# EAGLE design hs-256-expansion-debug (EAGLE 8.3.2)
DESIGNER: Jonathan P. Newman; DESIGN_NAME: headstage-256 Expansion Boards; LICENSE: CERN OHL v1.2; REVISION: 1.0
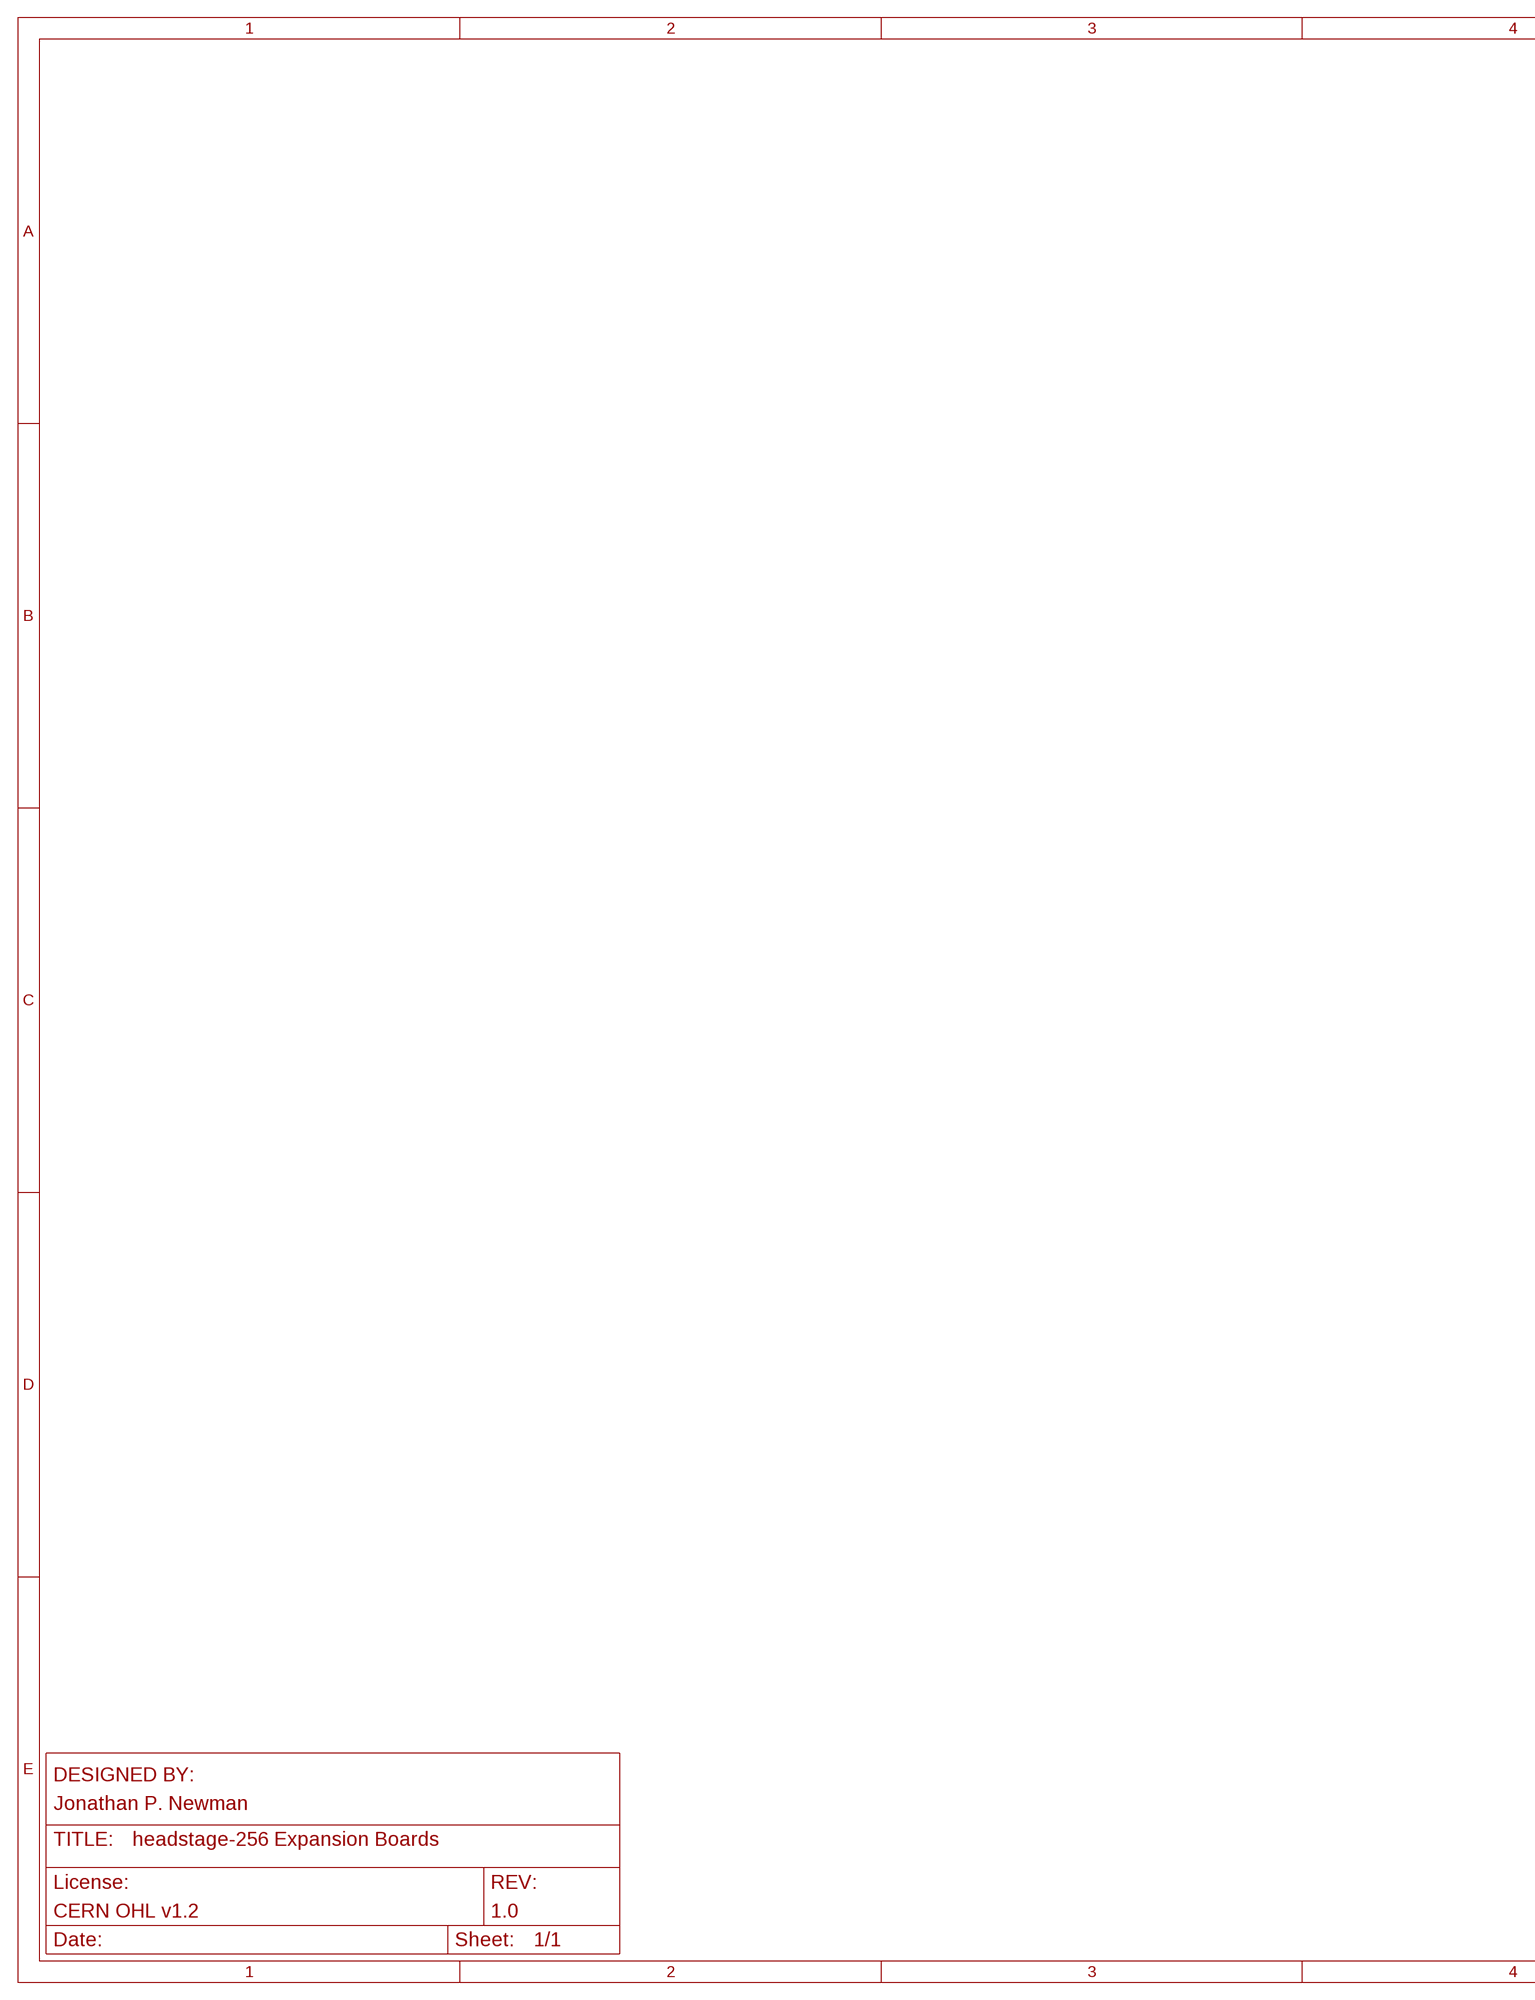
[diagram p0: schematic, sheet 1, part 1 of 2]
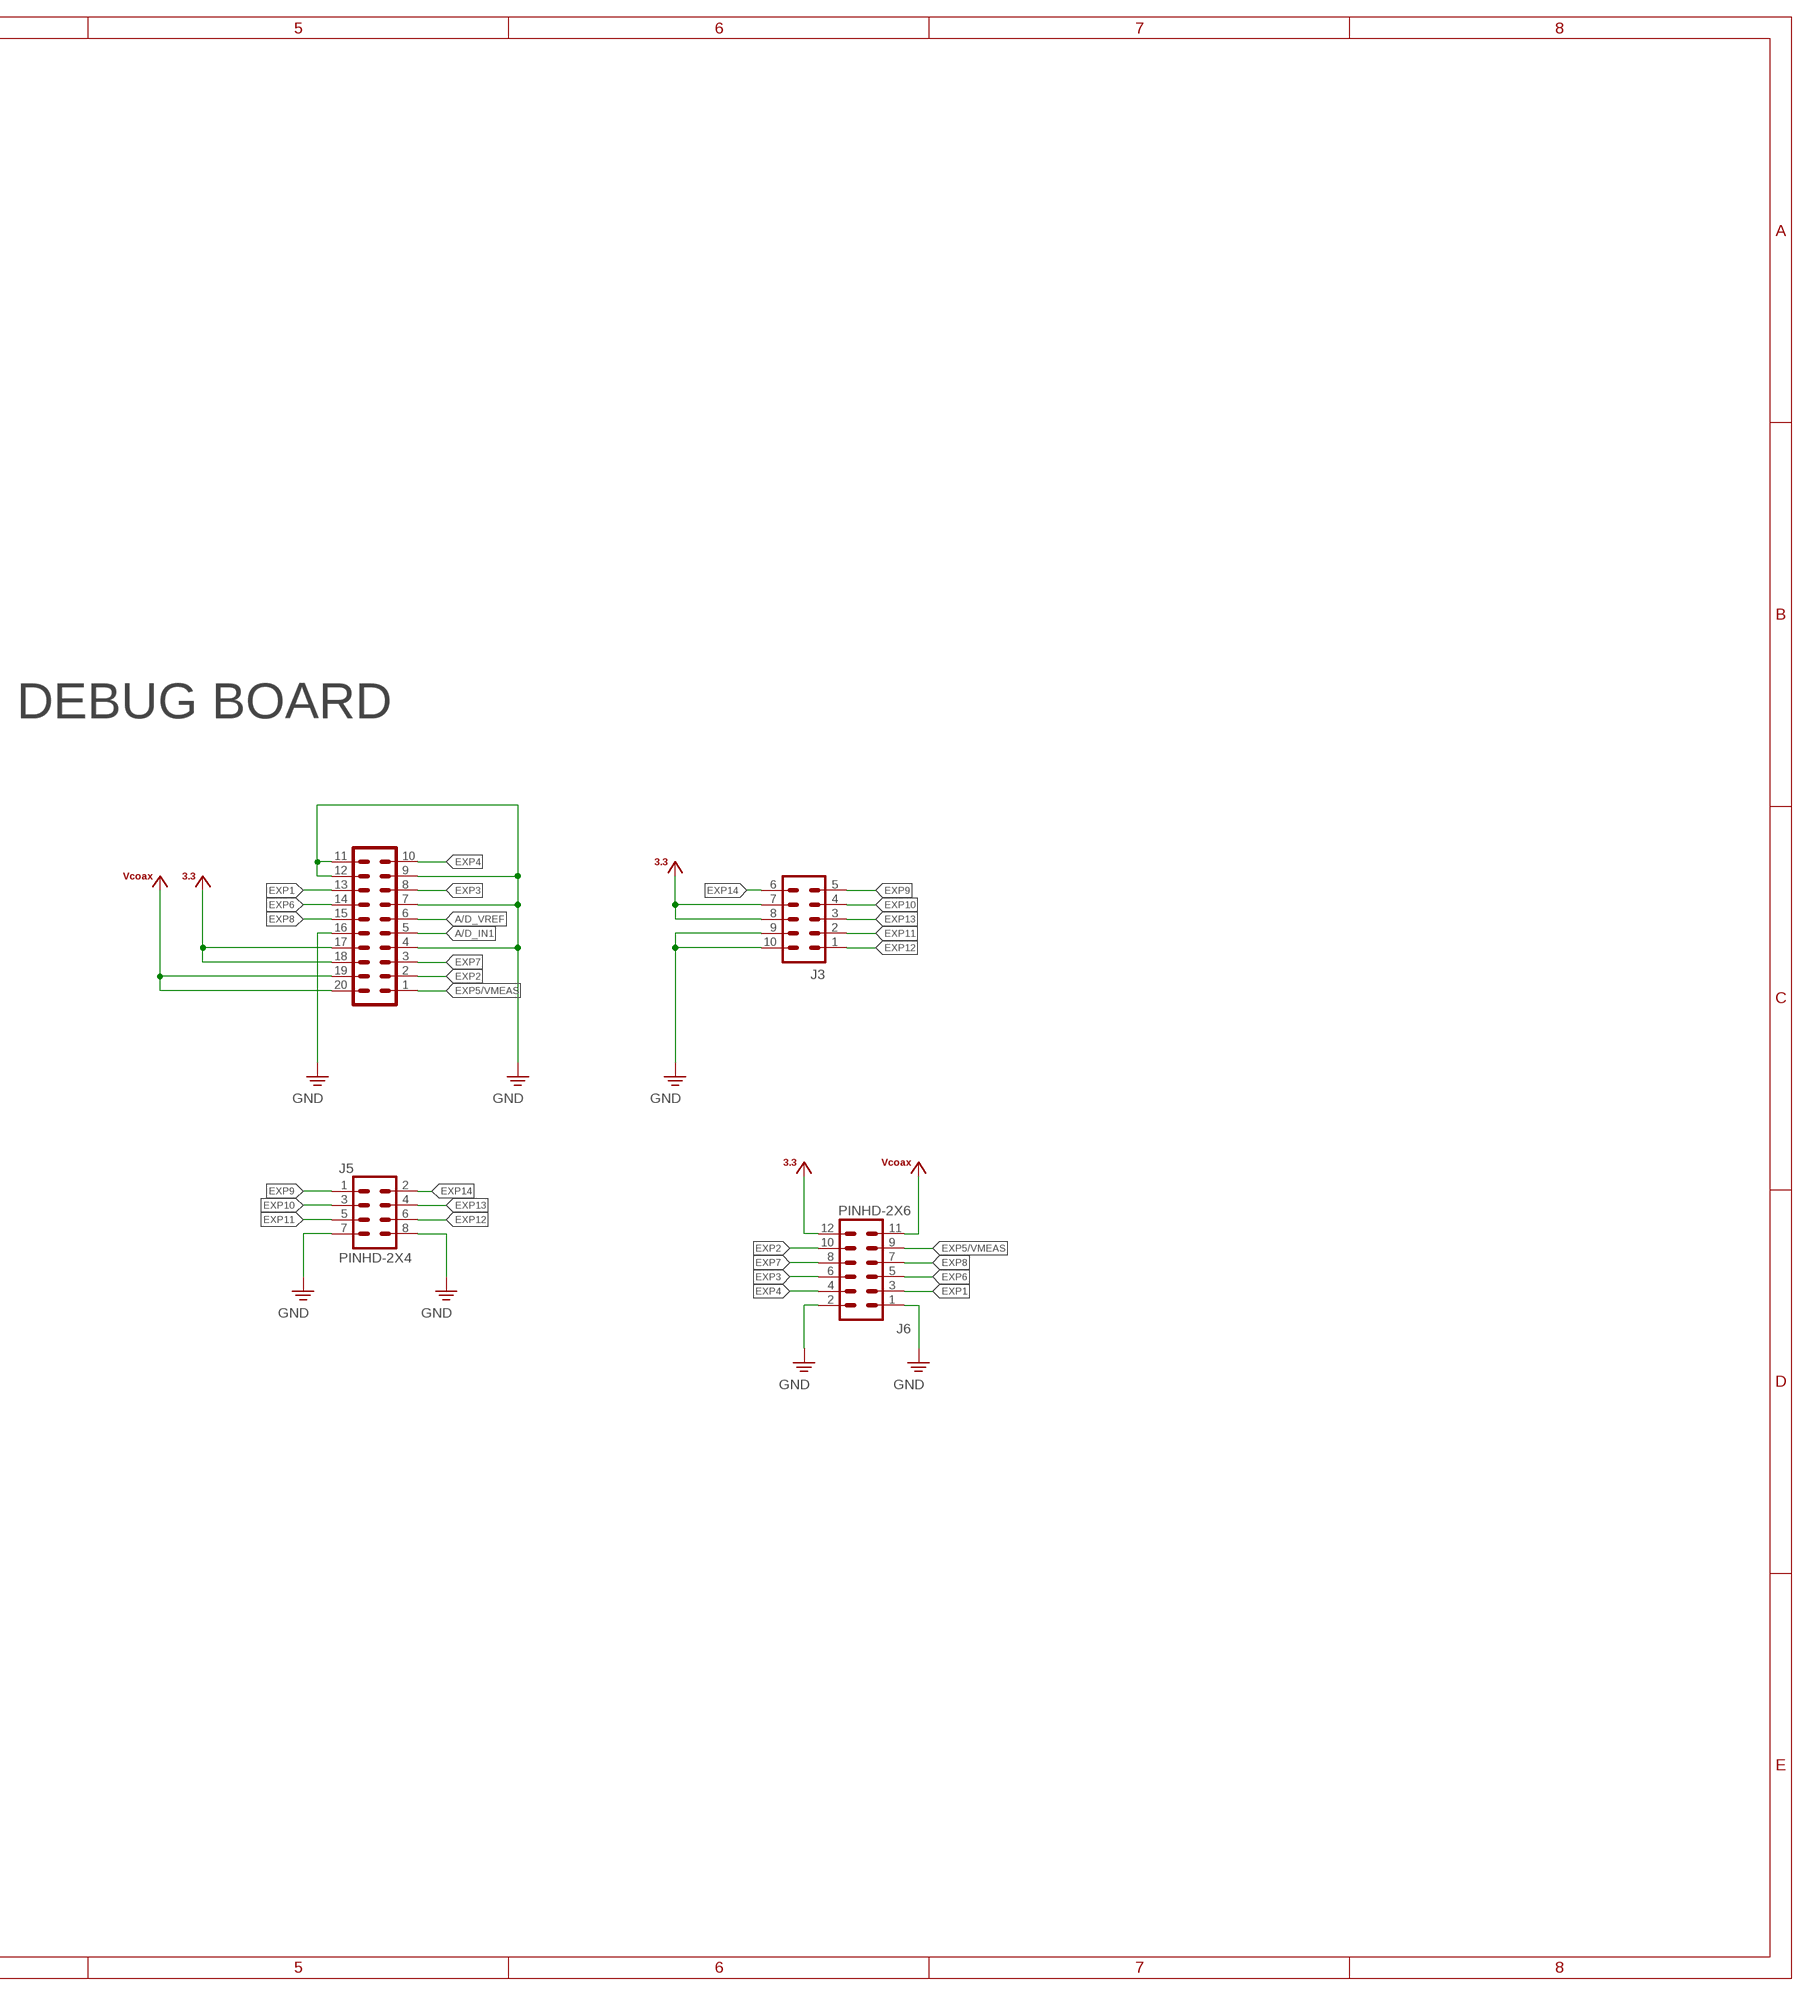
[diagram p1: schematic, sheet 1, part 2 of 2]

## Parts
J3  PINHD-2X5_DF40-REC  [DF40-10REC]
J4  PINHD-2X10_DF40-20REC  [DF40-20REC]
J5  PINHD-2X4  [2X04-BIG]
J6  PINHD-2X6  [2X06-BIG]

## Nets
+3V3: J3.7 J3.8 J4.17 J4.18 J6.12
A/D_IN1: J4.5
A/D_VREF: J4.6
EXP1: J4.13 J6.3
EXP2: J4.2 J6.10
EXP3: J4.8 J6.6
EXP4: J4.10 J6.4
EXP5/VMEAS: J4.1 J6.9
EXP6: J4.14 J6.5
EXP7: J4.3 J6.8
EXP8: J4.15 J6.7
EXP9: J3.5 J5.1
EXP10: J3.4 J5.3
EXP11: J3.2 J5.5
EXP12: J3.1 J5.6
EXP13: J3.3 J5.4
EXP14: J3.6 J5.2
GND: J3.9 J3.10 J4.4 J4.7 J4.9 J4.11 J4.12 J4.16 J5.7 J5.8 J6.1 J6.2
VCOAX: J4.19 J4.20 J6.11 ; supply symbol labelled +VCOAX

## Notes on the sheet
- DEBUG BOARD

## Library data of the parts
J3 = jonnew:PINHD-2X5
J4 = jonnew:PINHD-2X10
J5 = jonnew:PINHD-2X4
J6 = jonnew:PINHD-2X6

## Board
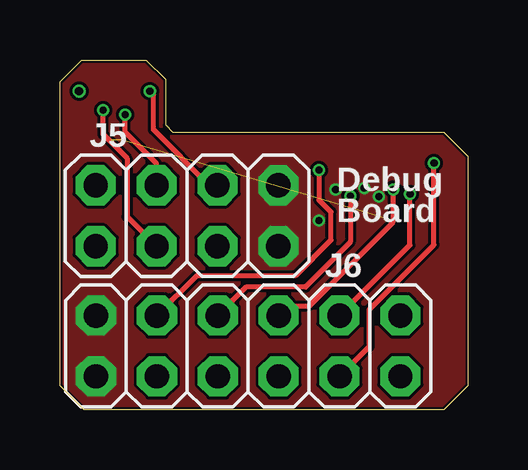
[diagram p2: board, top side]
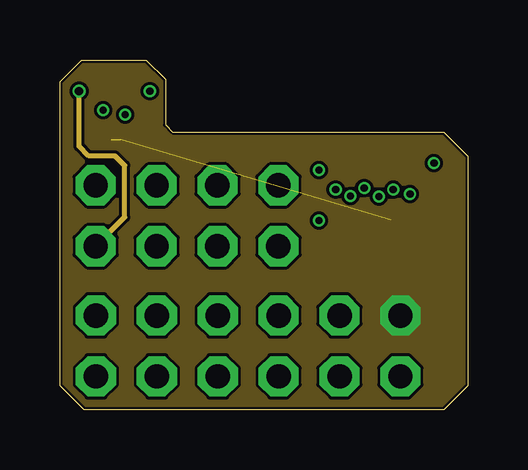
[diagram p3: board, inner layer Route2]
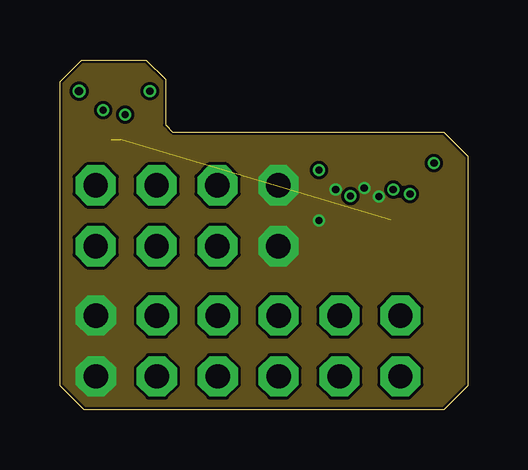
[diagram p4: board, inner layer Route15]
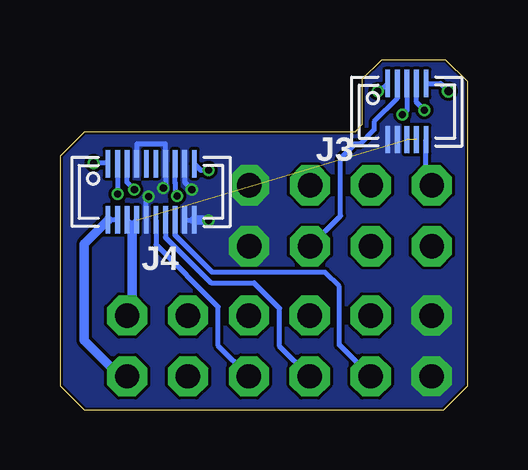
[diagram p5: board, bottom side, seen from below]

Size 17 x 14.6 mm. Coordinates in mm from the lower left corner, seen from the top.
Outline: 4.7,11.6 16,11.6 17,10.6 17,1 16,0 1,0 0,1 0,13.7 0.9,14.6 3.6,14.6 4.4,13.8 4.4,11.9 4.7,11.6
Copper layers (1*2*15*16): Top 0.035559375mm / dielectric 0.17018125mm / Route2 0.01778125mm / dielectric 47mil / Route15 0.01778125mm / dielectric 0.17018125mm / Bottom 0.035559375mm
Design rules "jlcpcb-4-layer": minimum track width 5mil, minimum drill 0.2mm, track to track 0.126490625mm, track to pad 0.126490625mm, pad to pad 0.126490625mm, via to via 0.126490625mm, smd to smd 0mil, copper to edge 0.1mm, drill to drill 5mil, minimum pad ring 4mil, minimum via ring 4mil, stop-mask expansion 3mil, vias tented up to drill 100mil, thermal gap 10mil

### Footprints (pad centres in the part's own frame; a part is rotated, then mirrored left to right if it is on the bottom)
DF40-10REC = smd 0.2 x 1.14: 1 -0.8,1.17; 2 -0.4,1.17; 3 0,1.17; 4 0.4,1.17; 5 0.8,1.17; 6 0.8,-1.17; 7 0.4,-1.17; 8 0,-1.17; 9 -0.4,-1.17; 10 -0.8,-1.17
DF40-20REC = smd 0.2 x 1.14: 1 -1.8,1.17; 2 -1.4,1.17; 3 -1,1.17; 4 -0.6,1.17; 5 -0.2,1.17; 6 0.2,1.17; 7 0.6,1.17; 8 1,1.17; 9 1.4,1.17; 10 1.8,1.17; 11 1.8,-1.17; 12 1.4,-1.17; 13 1,-1.17; 14 0.6,-1.17; 15 0.2,-1.17; 16 -0.2,-1.17; 17 -0.6,-1.17; 18 -1,-1.17; 19 -1.4,-1.17; 20 -1.8,-1.17
2X04-BIG = drill 1.016 pad 1.676 octagon: 1 -3.81,-1.27; 2 -3.81,1.27; 3 -1.27,-1.27; 4 -1.27,1.27; 5 1.27,-1.27; 6 1.27,1.27; 7 3.81,-1.27; 8 3.81,1.27
2X06-BIG = drill 1.016 pad 1.676 octagon: 1 0,0; 2 0,2.54; 3 2.54,0; 4 2.54,2.54; 5 5.08,0; 6 5.08,2.54; 7 7.62,0; 8 7.62,2.54; 9 10.16,0; 10 10.16,2.54; 11 12.7,0; 12 12.7,2.54

### Placement (x,y rotation side)
J3  2.53,12.45 0 bottom
J4  13.2,9.1 0 bottom
J5  5.3,8.1 0 top
J6  1.5,1.4 0 top

### Tracks (layer width: path | path; a pad name or v marks a point on that pad's centre or on a via)
+3V3  (2 unrouted)
  Bottom 0.2: J6.12 14.2,4.44 | 14,7.73 J4.18 | 14,7.73 14,7.3 | 14,7.73 J4.17
  Bottom 0.4: J6.12 arc-90 14,4.14 14,7.3
  pour Route2 (no thermals): -30.8,30.1 28,30.2 28,-19.8 -30.8,-19.9
EXP1
  Bottom 0.2: J4.13 12.2,7.3 10.64,5.74 5.94,5.74 5.35,5.15 5.35,2.71 J6.3
EXP2  (via drill 0.3)
  Top 0.2: J6.10 14.6,6.88 v14.6,9
  Bottom 0.2: J4.2 v14.6,9
EXP3  (via drill 0.3)
  Top 0.2: v12.11,8.92 12.11,7 10.24,5.13 7.77,5.13 J6.6
  Bottom 0.2: v12.11,8.92 12.19,9 12.19,9.47 12.2,9.48 J4.8
EXP4  (via drill 0.3)
  Top 0.2: v10.8,10 10.8,8.76 11.3,8.26 11.3,7.08 9.82,5.6 5.7,5.6 J6.4
  Bottom 0.2: J4.10 11.13,10 v10.8,10
EXP5/VMEAS  (via drill 0.3)
  Top 0.2: v15.6,10.3 15.6,6.88 12.9,4.19 12.9,2.64 J6.9
  Bottom 0.2: J4.1 15.03,10.3 v15.6,10.3
EXP6
  Bottom 0.2: J4.14 12.6,7.2 10.7,5.3 8.9,5.3 7.84,4.24 7.84,2.66 J6.5
EXP7  (via drill 0.3)
  Top 0.2: J6.8 9.53,4.35 10.4,4.35 13.9,7.85 v13.9,9.2
  Bottom 0.2: v13.9,9.2 14.2,9.5 J4.3
EXP8
  Bottom 0.2: J4.15 13,6.9 10.4,4.3 10.4,2.68 J6.7
EXP9  (via drill 0.35)
  Route2 0.2: J5.1 2.7,8.04 2.7,10.2 2.3,10.6 1.2,10.6 0.8,11 v0.8,13.3
  Bottom 0.2: J3.5 1.12,13.62 v0.8,13.3
EXP10  (via drill 0.3)
  Top 0.2: v1.8,12.5 1.8,11.5 2.8,10.5 2.8,8.06 J5.3
  Bottom 0.2: v1.8,12.5 2.13,12.83 J3.4
EXP11
  Bottom 0.2: J3.2 2.93,12.99 3.9,12.02 3.9,11.69 4.49,11.1 4.7,11.1 5.3,10.5 5.3,8.1 J5.5
EXP12  (via drill 0.3)
  Top 0.2: v3.75,13.3 3.9,13.15 3.9,11.69 6.22,9.37 J5.6
  Bottom 0.2: J3.1 3.65,13.3 v3.75,13.3
EXP13  (via drill 0.3)
  Top 0.2: v2.71,12.31 2.71,11.6 4.03,10.28 J5.4
  Bottom 0.2: v2.71,12.31 2.53,12.5 J3.3
EXP14
  Bottom 0.2: J5.2 1.73,9.61 J3.6
GND  (via drill 0.3)
  Bottom 0.2: J4.12 J4.11 | J4.16 13.4,8.7 v13.3,8.9 | J4.9 11.8,9.5 v11.5,9.2 | v12.69,9.26 12.6,9.35 J4.7 12.6,11.1 13.8,11.1 J4.4
  Bottom 0.4: v10.8,7.9 10.83,7.93 J4.11
  pour Route15 (no thermals): -31.8,31.1 29,31.2 29.5,-20.8 -31.8,-20.9
  pour Bottom (no thermals): -29.8,29.1 27,29.2 27,-18.8 -29.8,-18.9
  pour Top (no thermals): -28.8,28.1 26,28.2 26,-17.8 -28.8,-17.9
VCOAX
  Bottom 0.2: J4.19 J4.20
  Bottom 0.4: J4.20 16,6.93 16,2.9 14.5,1.4 J6.11

### Text on the board
tPlace: Debug / Board